# Altium schematic sheet lcd5v.SchDoc
size A4
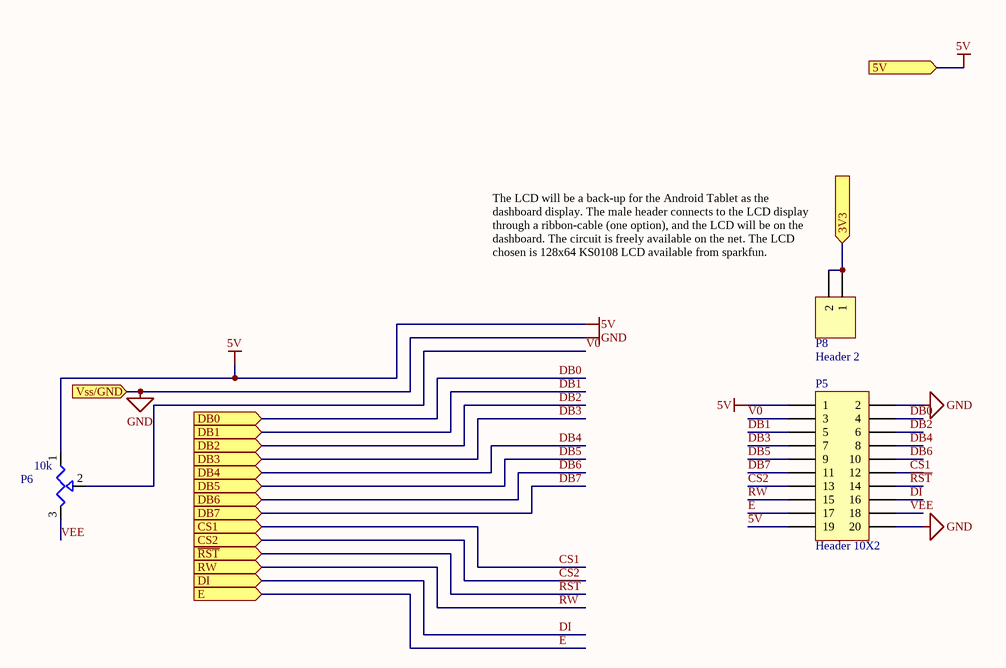
[diagram p0: lcd5v.SchDoc]

## Parts
P5  Header 10X2  [HDR2X10]
P6  value 10k  [TC33]  (hidden comment: Trimmer)
P8  Header 2  [HDR1X2]

## Ports
3V3 (in), 5V (in), CS1 (in), CS2 (in), DB0 (in), DB1 (in), DB2 (in), DB3 (in), DB4 (in), DB5 (in), DB6 (in), DB7 (in), DI (in), E (in), RW (in), Vss/GND (in), ~{RST} (in)

## Nets
5V: P5.1 P5.19 P6.1(CCW) ; port 5V
GND: P5.2 P5.20 ; port Vss/GND
3V3: P8.1 P8.2 ; port 3V3
~{RST}: P5.14 ; port ~{RST}
CS1: P5.12 ; port CS1
CS2: P5.13 ; port CS2
DB0: P5.4 ; port DB0
DB1: P5.5 ; port DB1
DB2: P5.6 ; port DB2
DB3: P5.7 ; port DB3
DB4: P5.8 ; port DB4
DB5: P5.9 ; port DB5
DB6: P5.10 ; port DB6
DB7: P5.11 ; port DB7
DI: P5.16 ; port DI
E: P5.17 ; port E
RW: P5.15 ; port RW
V0: P5.3 P6.2(WIPER)
VEE: P5.18 P6.3(CW)

## Notes on the sheet
- (near P8) The LCD will be a back-up for the Android Tablet as the dashboard display. The male header connects to the LCD display through a ribbon-cable (one option), and the LCD will be on the dashboard. The circuit is freely available on the net. The LCD chosen is 128x64 KS0108 LCD available from sparkfun.

## Library data of the parts
P5 = Header 10x2: Header, 10-Pin, Dual row; LatestRevisionDate: 17-Jul-2002; LatestRevisionNote: Re-released for DXP Platform.; Publisher: Altium Limited
P6 = TC33: 3mm SMD Trimming Pot; Manufacturer: Bourns
P8 = Header 2: Header, 2-Pin; LatestRevisionDate: 17-Jul-2002; LatestRevisionNote: Re-released for DXP Platform.; Publisher: Altium Limited